# EAGLE schematic aparture_v1 (EAGLE 6.3)
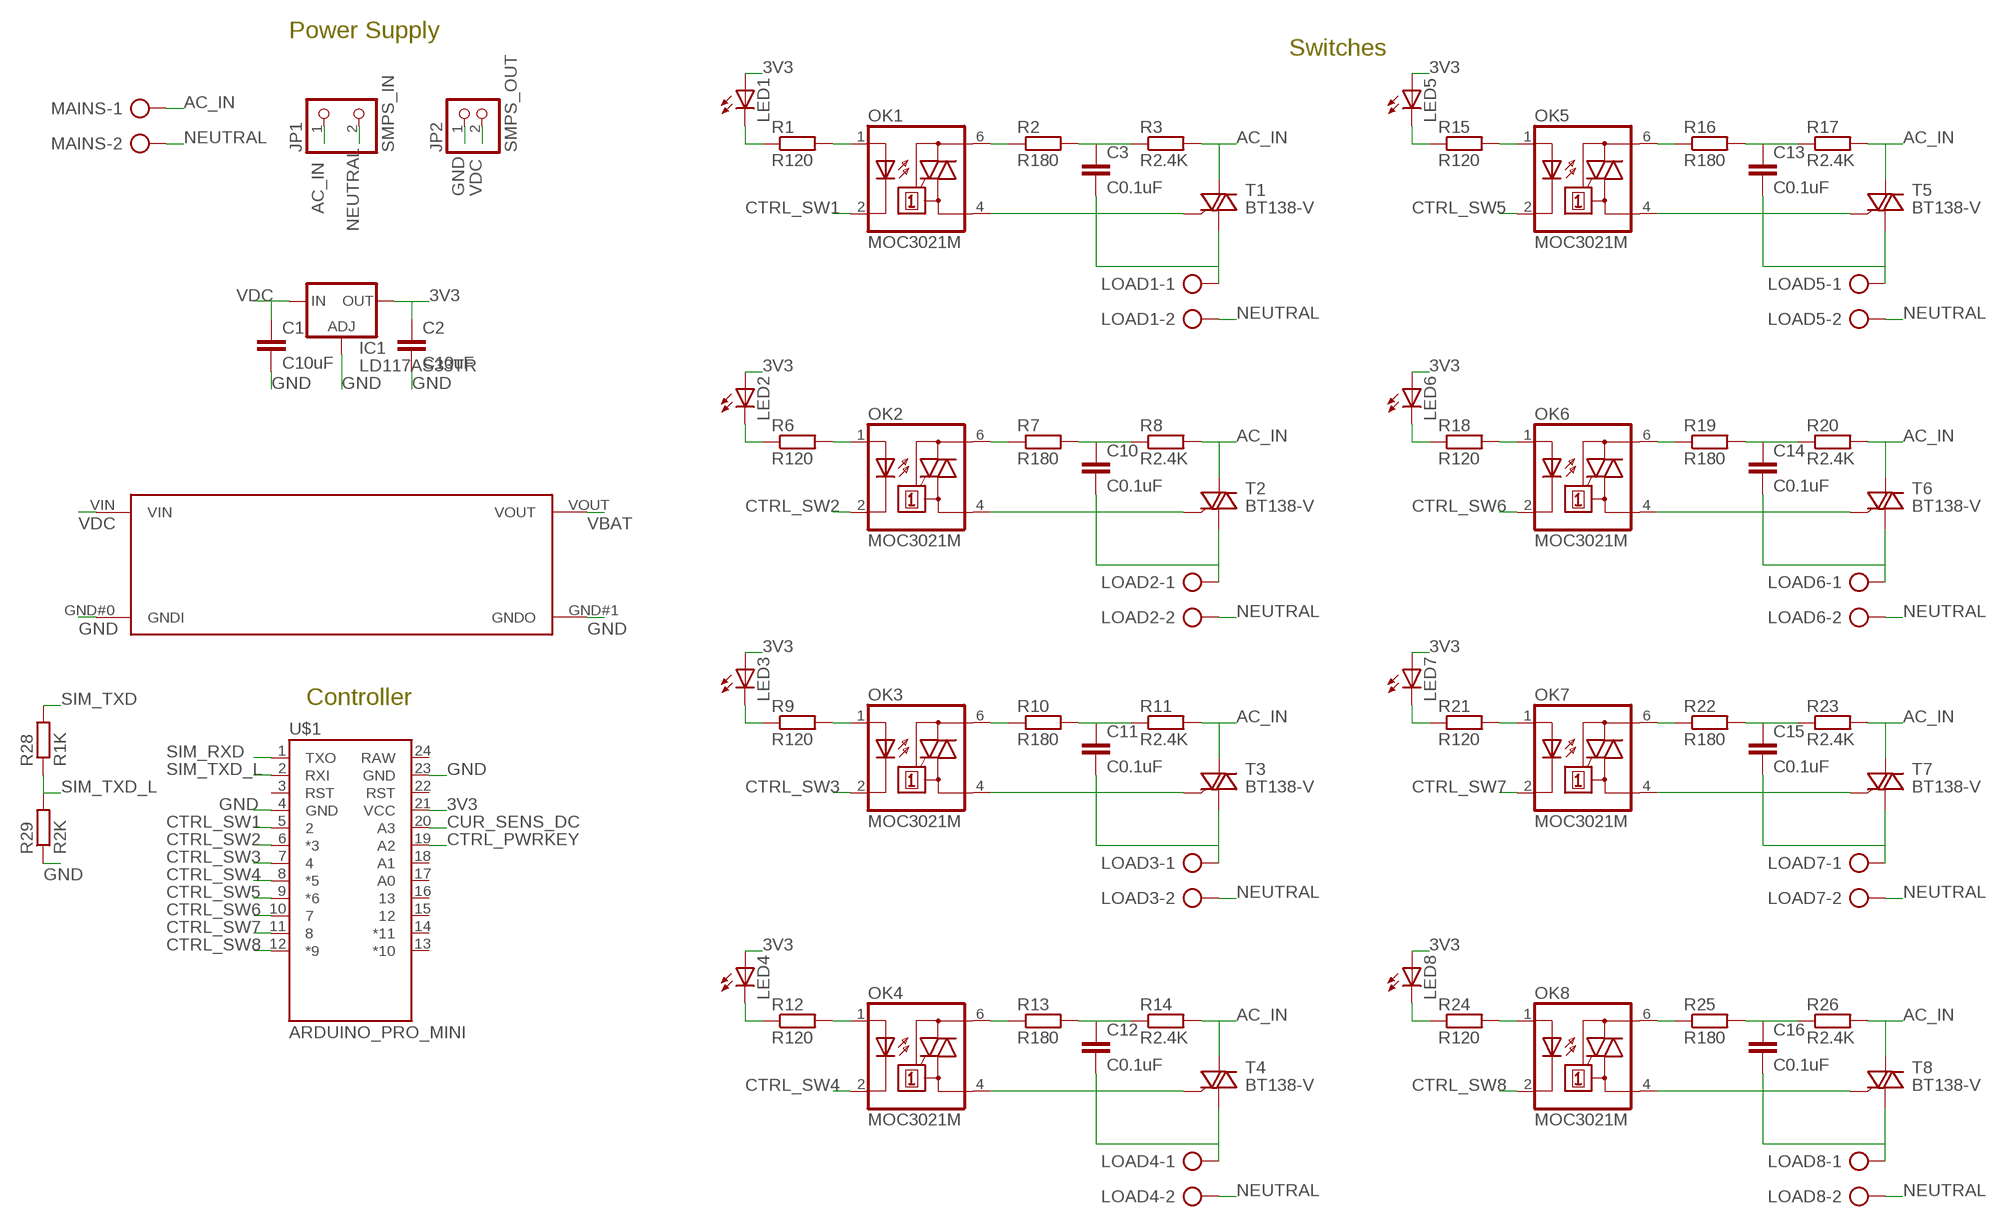
[diagram p0: schematic, sheet 1, part 1 of 2]
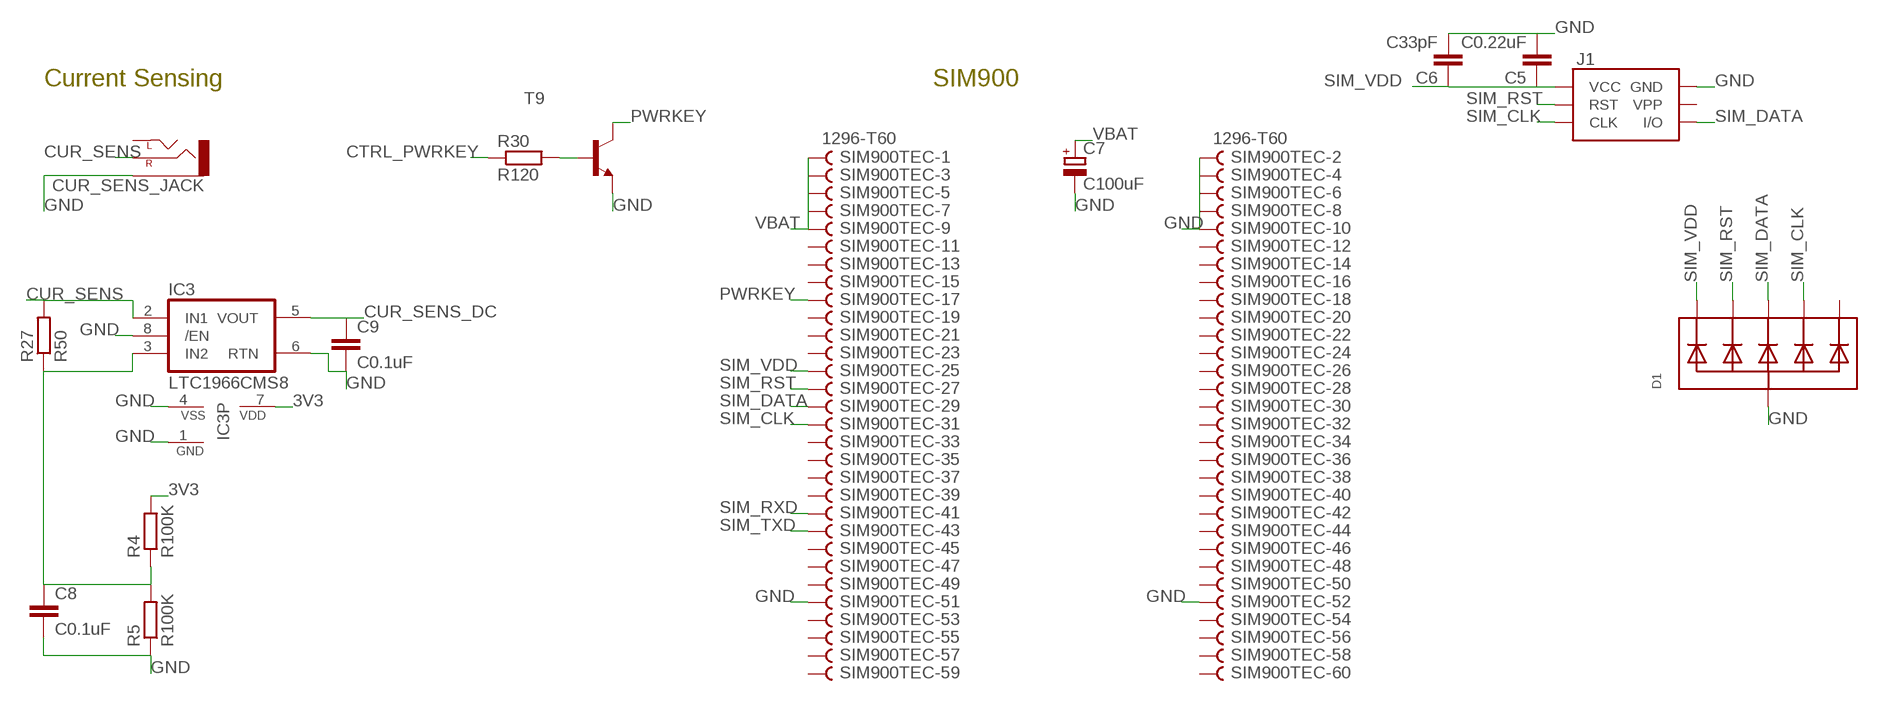
[diagram p1: schematic, sheet 1, part 2 of 2]

## Parts
C1  C10uF  C-EUC0805  [C0805]
C2  C10uF  C-EUC0805  [C0805]
C3  C0.1uF  C-EUC0805  [C0805]
C5  C0.22uF  C-EUC0805  [C0805]
C6  C33pF  C-EUC0805  [C0805]
C7  C100uF  CPOL-EU153CLV-0605  [153CLV-0605]
C8  C0.1uF  C-EUC0805  [C0805]
C9  C0.1uF  C-EUC0805  [C0805]
C10  C0.1uF  C-EUC0805  [C0805]
C11  C0.1uF  C-EUC0805  [C0805]
C12  C0.1uF  C-EUC0805  [C0805]
C13  C0.1uF  C-EUC0805  [C0805]
C14  C0.1uF  C-EUC0805  [C0805]
C15  C0.1uF  C-EUC0805  [C0805]
C16  C0.1uF  C-EUC0805  [C0805]
CUR_SENS_JACK  AUDIO-JACKSMD2  [AUDIO-JACK-3.5MM-SMD]
D1  TVSARRAY_5LANE  [SOT363]
IC1  LD117AS33TR  [SOT223]
IC3  LTC1966CMS8  [MSOP8]
J1  SIMHOLDERSIM  [SIMHOLDER]
JP1  SMPS_IN  [SMPS_IN]
JP2  SMPS_OUT  PINHD-1X2  [1X02]
LED1  LED3MM  [LED3MM]
LED2  LED3MM  [LED3MM]
LED3  LED3MM  [LED3MM]
LED4  LED3MM  [LED3MM]
LED5  LED3MM  [LED3MM]
LED6  LED3MM  [LED3MM]
LED7  LED3MM  [LED3MM]
LED8  LED3MM  [LED3MM]
LOAD1  AK300/2  [AK300/2]
LOAD2  AK300/2  [AK300/2]
LOAD3  AK300/2  [AK300/2]
LOAD4  AK300/2  [AK300/2]
LOAD5  AK300/2  [AK300/2]
LOAD6  AK300/2  [AK300/2]
LOAD7  AK300/2  [AK300/2]
LOAD8  AK300/2  [AK300/2]
MAINS  AK300/2  [AK300/2]
OK1  MOC3021M  [DIL06]
OK2  MOC3021M  [DIL06]
OK3  MOC3021M  [DIL06]
OK4  MOC3021M  [DIL06]
OK5  MOC3021M  [DIL06]
OK6  MOC3021M  [DIL06]
OK7  MOC3021M  [DIL06]
OK8  MOC3021M  [DIL06]
R1  R120  R-EU_M0805  [M0805]
R2  R180  R-EU_M0805  [M0805]
R3  R2.4K  R-EU_M0805  [M0805]
R4  R100K  R-EU_M0805  [M0805]
R5  R100K  R-EU_M0805  [M0805]
R6  R120  R-EU_M0805  [M0805]
R7  R180  R-EU_M0805  [M0805]
R8  R2.4K  R-EU_M0805  [M0805]
R9  R120  R-EU_M0805  [M0805]
R10  R180  R-EU_M0805  [M0805]
R11  R2.4K  R-EU_M0805  [M0805]
R12  R120  R-EU_M0805  [M0805]
R13  R180  R-EU_M0805  [M0805]
R14  R2.4K  R-EU_M0805  [M0805]
R15  R120  R-EU_M0805  [M0805]
R16  R180  R-EU_M0805  [M0805]
R17  R2.4K  R-EU_M0805  [M0805]
R18  R120  R-EU_M0805  [M0805]
R19  R180  R-EU_M0805  [M0805]
R20  R2.4K  R-EU_M0805  [M0805]
R21  R120  R-EU_M0805  [M0805]
R22  R180  R-EU_M0805  [M0805]
R23  R2.4K  R-EU_M0805  [M0805]
R24  R120  R-EU_M0805  [M0805]
R25  R180  R-EU_M0805  [M0805]
R26  R2.4K  R-EU_M0805  [M0805]
R27  R50  R-EU_M0805  [M0805]
R28  R1K  R-EU_M0805  [M0805]
R29  R2K  R-EU_M0805  [M0805]
R30  R120  R-EU_M0805  [M0805]
SIM900TEC  1296-T60  [1296-60]
T1  BT138-V  [TO220BV]
T2  BT138-V  [TO220BV]
T3  BT138-V  [TO220BV]
T4  BT138-V  [TO220BV]
T5  BT138-V  [TO220BV]
T6  BT138-V  [TO220BV]
T7  BT138-V  [TO220BV]
T8  BT138-V  [TO220BV]
T9  MMBT2222ALT1-NPN-SOT23-BEC  [SOT23-BEC]
U$1  ARDUINO_PRO_MINI  [ARDUINO_PRO_MINI]
VOL_REG_SIM900  DCDCMODULE  [DCDCMODULE]

## Nets
3V3: C2.1 IC1.4(OUT) IC3.7(VDD) LED1.A LED2.A LED3.A LED4.A LED5.A LED6.A LED7.A LED8.A R4.2 U$1.21(VCC)
AC_IN: JP1.1 MAINS.1 R3.2 R8.2 R11.2 R14.2 R17.2 R20.2 R23.2 R26.2 T1.T2(A2) T2.T2(A2) T3.T2(A2) T4.T2(A2) T5.T2(A2) T6.T2(A2) T7.T2(A2) T8.T2(A2)
CTRL_PWRKEY: R30.1 U$1.19(A2)
CTRL_SW1: OK1.2(C) U$1.5
CTRL_SW2: OK2.2(C) U$1.6(*3)
CTRL_SW3: OK3.2(C) U$1.7
CTRL_SW4: OK4.2(C) U$1.8(*5)
CTRL_SW5: OK5.2(C) U$1.9(*6)
CTRL_SW6: OK6.2(C) U$1.10
CTRL_SW7: OK7.2(C) U$1.11
CTRL_SW8: OK8.2(C) U$1.12(*9)
CUR_SENS: CUR_SENS_JACK.RING(RIGHT) IC3.2(IN1) R27.2
CUR_SENS_DC: C9.1 IC3.5(VOUT) U$1.20(A3)
GND: C1.2 C2.2 C5.2 C6.2 C7.- C8.2 C9.2 CUR_SENS_JACK.SLEEVE D1.2(A) IC1.1(ADJ) IC3.1(GND) IC3.4(VSS) IC3.6(RTN) IC3.8(/EN) J1.C5(GND) JP2.1 R5.1 R29.1 SIM900TEC.2 SIM900TEC.4 SIM900TEC.6 SIM900TEC.8 SIM900TEC.10 SIM900TEC.51 SIM900TEC.52 T9.E U$1.4(GND) U$1.23(GND) VOL_REG_SIM900.GND#0(GNDI) VOL_REG_SIM900.GND#1(GNDO)
N$1: LED1.K(C) R1.1
N$2: OK1.1(A) R1.2
N$3: OK1.6(A2) R2.1
N$4: C3.1 R2.2 R3.1
N$5: OK1.4(A1) T1.G
N$6: C3.2 LOAD1.1 T1.T1(A1)
N$7: C8.1 IC3.3(IN2) R4.1 R5.2 R27.1
N$8: R30.2 T9.B
N$10: LED2.K(C) R6.1
N$11: OK2.1(A) R6.2
N$12: OK2.6(A2) R7.1
N$13: C10.1 R7.2 R8.1
N$14: OK2.4(A1) T2.G
N$15: C10.2 LOAD2.1 T2.T1(A1)
N$16: LED3.K(C) R9.1
N$17: OK3.1(A) R9.2
N$18: OK3.6(A2) R10.1
N$19: C11.1 R10.2 R11.1
N$20: OK3.4(A1) T3.G
N$21: C11.2 LOAD3.1 T3.T1(A1)
N$22: LED4.K(C) R12.1
N$23: OK4.1(A) R12.2
N$24: OK4.6(A2) R13.1
N$25: C12.1 R13.2 R14.1
N$26: OK4.4(A1) T4.G
N$27: C12.2 LOAD4.1 T4.T1(A1)
N$28: LED5.K(C) R15.1
N$29: OK5.1(A) R15.2
N$30: OK5.6(A2) R16.1
N$31: C13.1 R16.2 R17.1
N$32: OK5.4(A1) T5.G
N$33: C13.2 LOAD5.1 T5.T1(A1)
N$34: LED6.K(C) R18.1
N$35: OK6.1(A) R18.2
N$36: OK6.6(A2) R19.1
N$37: C14.1 R19.2 R20.1
N$38: OK6.4(A1) T6.G
N$39: C14.2 LOAD6.1 T6.T1(A1)
N$40: LED7.K(C) R21.1
N$41: OK7.1(A) R21.2
N$42: OK7.6(A2) R22.1
N$43: C15.1 R22.2 R23.1
N$44: OK7.4(A1) T7.G
N$45: C15.2 LOAD7.1 T7.T1(A1)
N$46: LED8.K(C) R24.1
N$47: OK8.1(A) R24.2
N$48: OK8.6(A2) R25.1
N$49: C16.1 R25.2 R26.1
N$50: OK8.4(A1) T8.G
N$51: C16.2 LOAD8.1 T8.T1(A1)
NEUTRAL: JP1.2 LOAD1.2 LOAD2.2 LOAD3.2 LOAD4.2 LOAD5.2 LOAD6.2 LOAD7.2 LOAD8.2 MAINS.2
PWRKEY: SIM900TEC.17 T9.C
SIM_CLK: D1.5(C4) J1.C3(CLK) SIM900TEC.31
SIM_DATA: D1.4(C3) J1.C7(I/O) SIM900TEC.29
SIM_RST: D1.3(C2) J1.C2(RST) SIM900TEC.27
SIM_RXD: SIM900TEC.41 U$1.1(TXO)
SIM_TXD: R28.2 SIM900TEC.43
SIM_TXD_L: R28.1 R29.2 U$1.2(RXI)
SIM_VDD: C5.1 C6.1 D1.1(C1) J1.C1(VCC) SIM900TEC.25
VBAT: C7.+ SIM900TEC.1 SIM900TEC.3 SIM900TEC.5 SIM900TEC.7 SIM900TEC.9 VOL_REG_SIM900.VOUT
VDC: C1.1 IC1.3(IN) JP2.2 VOL_REG_SIM900.VIN
Unconnected: CUR_SENS_JACK.TIP(LEFT) D1.6(C5) J1.C6(VPP) SIM900TEC.11 SIM900TEC.12 SIM900TEC.13 SIM900TEC.14 SIM900TEC.15 SIM900TEC.16 SIM900TEC.18 SIM900TEC.19 SIM900TEC.20 SIM900TEC.21 SIM900TEC.22 SIM900TEC.23 SIM900TEC.24 SIM900TEC.26 SIM900TEC.28 SIM900TEC.30 SIM900TEC.32 SIM900TEC.33 SIM900TEC.34 SIM900TEC.35 SIM900TEC.36 SIM900TEC.37 SIM900TEC.38 SIM900TEC.39 SIM900TEC.40 SIM900TEC.42 SIM900TEC.44 SIM900TEC.45 SIM900TEC.46 SIM900TEC.47 SIM900TEC.48 SIM900TEC.49 SIM900TEC.50 SIM900TEC.53 SIM900TEC.54 SIM900TEC.55 SIM900TEC.56 SIM900TEC.57 SIM900TEC.58 SIM900TEC.59 SIM900TEC.60 U$1.3(RST) U$1.13(*10) U$1.14(*11) U$1.15 U$1.16 U$1.17(A0) U$1.18(A1) U$1.22(RST) U$1.24(RAW)

## Notes on the sheet
- Power Supply
- Switches
- Current Sensing | SIM900
- Controller

## Library data of the parts
C1-C3 C5 C6 C8-C16 = resistor:C-EU: CAPACITOR, European symbol
C7 = resistor:CPOL-EU: POLARIZED CAPACITOR, European symbol
CUR_SENS_JACK = SparkFun-Connectors:AUDIO-JACK: 3.5mm Audio Jack Simple 3.5mm common PCB mount audio jack. SKU: PRT-08032; PROD_ID: CONN-10353
D1 = microbuilder:TVSARRAY_5LANE: Voltage Transient Suppressor Array SOT363 SMF05C - 100W 5V: Digikey - SMF05CT1GOSCT-ND
IC1 = v-reg:LD117A?*: Low drop fixed and adjustable positive voltage regulators 1 A Source: http://www.st.com/stonline/products/literature/ds/7194/ld1117axx.pdf
IC3 = linear-technology-2:LTC1966*: Precision Micropower, DS RMS-to-DC Converter
J1 = SparkFun-Connectors:SIMHOLDER: SIM Socket Socket for SIM cellular cards. Schematic element and footprint production proven. Spark Fun Electronics SKU : PRT-00548; PROD_ID: CONN-08536
JP1 = tigorcustom:SMPS_IN: PIN HEADER
JP2 = pinhead:PINHD-1X2: PIN HEADER
LED1-LED8 = adafruit:LED: LED OSRAM: - CHIPLED LG R971, LG N971, LY N971, LG Q971, LY Q971, LO R971, LY R971 LH N974, LH R974 LS Q976, LO Q976, LY Q976 LO Q996 - Hyper CHIPLED LW Q18S LB Q993, LB Q99A, LB R99A - SideLED LS A670, LO A670, LY A670, LG A670, LP A670 LB A673, LV A673, LT A673, LW A673 LH A674 LY A675 LS A676, LA A676, LO A676, LY A676, LW A676 LS A679, LY A679, LG A679 - Hyper Micro SIDELED® LS Y876, LA Y876, LO Y876, LY Y876 LT Y87S - SmartLED LW L88C, LW L88S LB L89C, LB L89S, LG L890 LS L89K, LO L89K, LY L89K LS L896, LA L896, LO L896, LY L896 - TOPLED LS T670, LO T670, LY T670, LG T670, LP T670 LSG T670, LSP T670, LSY T670, LOP T670, LYG T670 LG T671, LOG T671, LSG T671 LB T673, LV T673, LT T673, LW T673 LH T674 LS T676, LA T676, LO T676, LY T676, LB T676, LH T676, LSB T676, LW T676 LB T67C, LV T67C, LT T67C, LS T67K, LO T67K, LY T67K, LW E67C LS E67B, LA E67B, LO E67B, LY E67B, LB E67C, LV E67C, LT E67C LW T67C LS T679, LY T679, LG T679 LS T770, LO T770, LY T770, LG T770, LP T770 LB T773, LV T773, LT T773, LW T773 LH T774 LS E675, LA E675, LY E675, LS T675 LS T776, LA T776, LO T776, LY T776, LB T776 LHGB T686 LT T68C, LB T68C - Hyper Mini TOPLED® LB M676 - Mini TOPLED Santana® LG M470 LS M47K, LO M47K, LY M47K Source: http://www.osram.convergy.de/
LOAD1-LOAD8 MAINS = con-ptr500:AK300/2: CONNECTOR; OC_FARNELL: unknown; OC_NEWARK: unknown
OK1-OK8 = optocoupler:MOC30*M: RANDOM-PHASE OPTOISOLATORS TRIAC DRIVER OUTPUT Source: http://www.fairchildsemi.com MOC3020-M.pdf; MF: FAIRCHILD SEMICONDUCTOR; MPN: MOC3021-M; OC_FARNELL: 1021365; OC_NEWARK: 95B7895
R1-R30 = resistor:R-EU_: RESISTOR, European symbol
SIM900TEC = con-leotronics:1296-T60: 1.27mm SINGLE ROW FEMALE SOCKET Source: http://www.leotronics.co.uk/Conexcon/Data%20Sheets/sec.%20A/1296ing.pdf; OC_FARNELL: unknown; OC_NEWARK: unknown
T1-T8 = triac:BT138: TRIAC Source: http://www.semiconductors.philips.com BT138_SERIES_2.pdf
T9 = transistor-neu-to92:*-NPN-: NPN Transistror
U$1 = tigorcustom:ARDUINO_PRO_MINI
VOL_REG_SIM900 = bontor:DCDCMODULE